# Altium schematic sheet BlockDiagram.SchDoc: Title
size B; Organization: Midnight Sun Solar Rayce Car Team; Address1: University of Waterloo; Address2: 200 University Ave W; Address3: Waterloo, ON, Canada; Address4: N2L 3E9; Website: www.uwmidsun.com; ProjectName: ProjectName
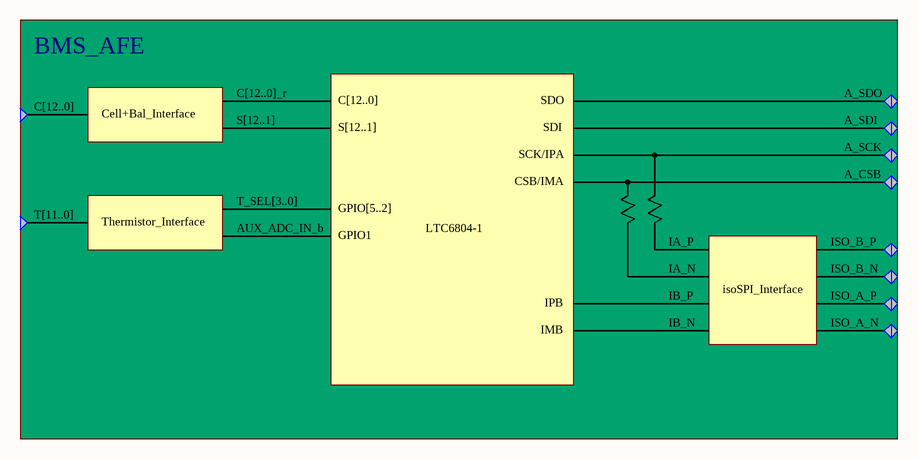
[diagram p0: BlockDiagram.SchDoc]

## Notes on the sheet
- BMS_AFE
- C[12..0]
- C[12..0]_r
- SDO
- A_SDO
- Cell+Bal_Interface
- S[12..1]
- CSB/IMA
- SCK/IPA
- SDI
- A_SDI
- A_SCK
- A_CSB
- T[11..0]
- Thermistor_Interface
- AUX_ADC_IN_b
- T_SEL[3..0]
- GPIO[5..2]
- GPIO1
- LTC6804-1
- IA_P
- ISO_B_P
- IPB
- IA_N
- IB_P
- isoSPI_Interface
- ISO_B_N
- ISO_A_P
- IMB
- IB_N
- ISO_A_N
- PROJECT
- DOCUMENT
- DRAWN BY
- LAST MODIFIED
- PART NUMBER
- REVISION
- SHEET
- VARIANT
- OF
- Engineering 5 - 1002
  University of Waterloo
  (519) 888-4567 x32978
  hardware@uwmidsun.com